# Altium schematic sheet DRV8316.SchDoc
size A4; SheetNumber: 3; SheetTotal: 4
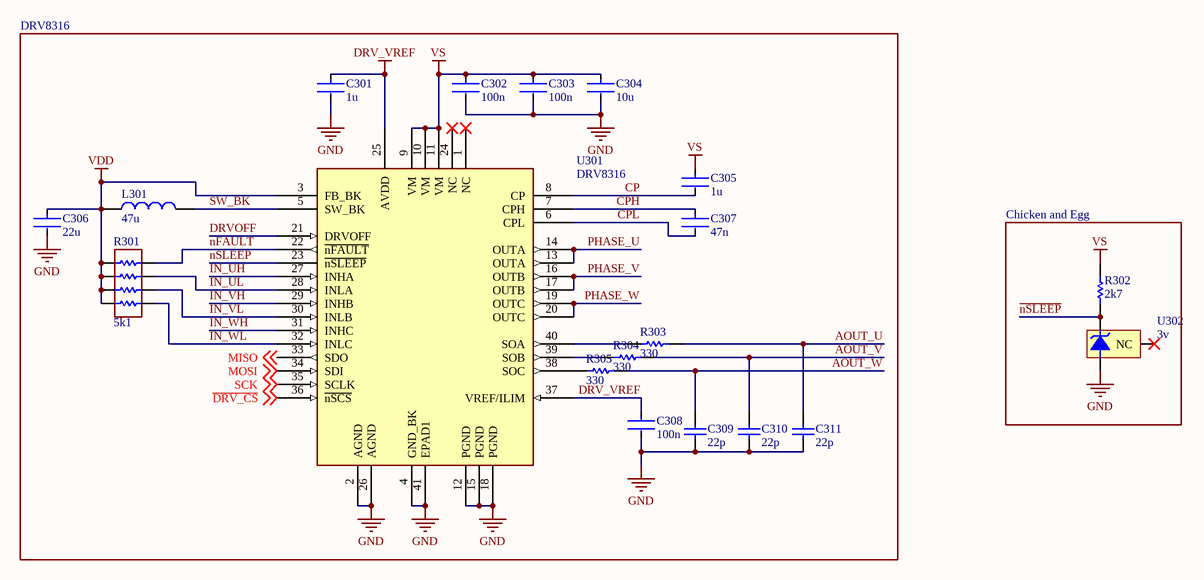
[diagram p0: DRV8316.SchDoc]

## Parts
C301  1u  [FP-GRM155-0_1-MFG]
C302  100n  [FP-GCM155-0_05-MFG]
C303  100n  [FP-GCM155-0_05-MFG]
C304  10u  [FP-GRT31C-0_2-IPC_C]
C305  1u  [FP-GRM155-0_1-MFG]
C306  22u  [FP-GRM188-0_2-IPC_C]
C307  47n  [FP-GRM155-0_05-MFG]
C308  100n  [FP-GCM155-0_05-MFG]
C309  22p  [CAPC1005X55X25LL05T10]
C310  22p  [CAPC1005X55X25LL05T10]
C311  22p  [CAPC1005X55X25LL05T10]
L301  47u  [INDC3225X25N]
R301  5k1  [CAC-50P200X100-8L]
R302  2k7  [RESC1005X04N]
R303  330  [RESC1005X04N]
R304  330  [RESC1005X04N]
R305  330  [RESC1005X04N]
U301  DRV8316  [QFN50P500X700X100_HS-41L]
U302  3v  [SOT95P237X112-3L]

## Blocks framed on the sheet
DRV8316: C301-C311 L301 R301 R303-R305 U301
Chicken and Egg: R302 U302

## Nets
DRV_VREF: C301.1 C308.1 U301.25(AVDD) U301.37(VREF/ILIM)
GND: C301.2 C302.2 C303.2 C304.2 C306.2 C308.2 C309.1 C310.1 C311.1 U301.2(AGND) U301.4(GND_BK) U301.12(PGND) U301.15(PGND) U301.18(PGND) U301.26(AGND) U301.41(EPAD1) U302.2(-V)
VDD: C306.1 L301.1 R301.1 R301.2 R301.3 R301.4 U301.3(FB_BK)
VS: C302.1 C303.1 C304.1 C305.1 R302.2 U301.9(VM) U301.10(VM) U301.11(VM)
~{DRV_CS}: U301.36(~{nSCS}) ; off-sheet ~{DRV_CS}
~{nFAULT}: R301.8 U301.22(~{nFAULT})
~{nSLEEP}: R302.1 U301.23(~{nSLEEP}) U302.1(+V)
AOUT_U: C311.2 R303.2
AOUT_V: C310.2 R304.2
AOUT_W: C309.2 R305.2
CP: C305.2 U301.8(CP)
CPH: C307.1 U301.7(CPH)
CPL: C307.2 U301.6(CPL)
DRVOFF: U301.21(DRVOFF)
IN_UH: U301.27(INHA)
IN_UL: R301.7 U301.28(INLA)
IN_VH: U301.29(INHB)
IN_VL: R301.6 U301.30(INLB)
IN_WH: U301.31(INHC)
IN_WL: R301.5 U301.32(INLC)
MISO: U301.33(SDO) ; off-sheet MISO
MOSI: U301.34(SDI) ; off-sheet MOSI
PHASE_U: U301.13(OUTA) U301.14(OUTA)
PHASE_V: U301.16(OUTB) U301.17(OUTB)
PHASE_W: U301.19(OUTC) U301.20(OUTC)
SCK: U301.35(SCLK) ; off-sheet SCK
SW_BK: L301.2 U301.5(SW_BK)
NetR303_1: R303.1 U301.40(SOA)
NetR304_1: R304.1 U301.39(SOB)
NetR305_1: R305.1 U301.38(SOC)

Not connected (* = marked no-connect by the designer): U301 1(NC)* 24(NC)*; U302 3(NC)*

## Library data of the parts
C301 C305 = GRM155R61H105ME05D: Chip Multilayer Ceramic Capacitors for General Purpose, 0402, 1.0uF, X5R, 15%, 20%, 50V; Supplier 1: Digi-Key; Supplier Part Number 1: 490-GRM155R61H105ME05DTR-ND
C302 C303 C308 = GCM155R71H104KE02J: Ceramic Capacitor for Automotive 100nF ±10% 50VDC X7R 0402 Paper T/R; Voltage Rating (DC): 50V; Case Code (Metric): 1005; Dielectric: X7R; Capacitance: 100nF; Packaging: Tape and Reel; Min Operating Temperature: -55°C; Length: 0.039inch; Thickness: 0.022inch; Height: 0.5mm; Mount: Surface Mount; Termination: SMD/SMT; Voltage Rating: 50V; Package Quantity: 50000; Width: 0.02inch; Case/Package: 0402; Case Code (Imperial): 0402; Ratings: AEC-Q200; Max Operating Temperature: 125°C; Tolerance: 10%; Weight: 0.000212oz; Supplier 1: Digi-Key; Supplier Part Number 1: 490-14514-1-ND
C304 = GRT31CR61H106ME01L: CAP CER 10UF 50V X5R 1206; Tolerance: 20%; Length: 0.126inch; Mount: Surface Mount; Packaging: Tape and Reel; Capacitance: 10uF; Case/Package: 1206; Case Code (Imperial): 1206; Max Operating Temperature: 85°C; Voltage Rating: 50V; Ratings: AEC-Q200; Min Operating Temperature: -55°C; Thickness: 0.071inch; Width: 0.063inch; Case Code (Metric): 3216; Supplier 1: Digi-Key; Supplier Part Number 1: 490-12457-1-ND
C306 = GRM188R60J226MEA0J: Chip Multilayer Ceramic Capacitors for General Purpose, 0603, 22uF, X5R, 15%, 20%, 6.3V; Capacitance: 22uF; Case Code (Metric): 1608; Thickness: 0.039inch; Dielectric: X5R; Voltage Rating: 6.3V; Termination: SMD/SMT; Voltage Rating (DC): 6.3V; Width: 0.031inch; Weight: 0.000222oz; Tolerance: 20%; Case/Package: 0603; Lead Free: Lead Free; Package Quantity: 10000; Case Code (Imperial): 0603; Length: 0.063inch; Packaging: Tape and Reel; Max Operating Temperature: 85°C; Min Operating Temperature: -55°C; Mount: Surface Mount; Supplier 1: Future Electronics; Supplier Part Number 1: 2075839
C307 = GRM155R71H473KE14D: Chip Multilayer Ceramic Capacitors for General Purpose, 0402, 47000pF, X7R, 15%, 10%, 50V; Capacitance: 47nF; Tolerance: 10%; Max Operating Temperature: 125°C; Termination: SMD/SMT; Width: 0.02inch; Package Quantity: 10000; Resistor Type: Ceramic; Packaging: Tape and Reel; Height: 0.5mm; Voltage Rating (DC): 50V; Length: 0.039inch; Dielectric: X7R; Case Code (Imperial): 0402; Voltage Rating: 50V; Mount: Surface Mount; Min Operating Temperature: -55°C; Case Code (Metric): 1005; Weight: 0.000212oz; Case/Package: 0402; Thickness: 0.022inch; Supplier 1: Digi-Key; Supplier Part Number 1: 490-10702-1-ND
C309-C311 = GRM1555C1H220GA01D: Manufacturer: Murata; Part Number: GRM1555C1H220GA01D; Supplier 1: Digi-Key; Supplier Part Number 1: 490-6219-1-ND
L301 = L1210R470KDWIT: Supplier 1: Newark; Supplier Part Number 1: 50AC9370
R301 = EXB-28V512JX: Supplier 1: Digi-Key; Supplier Part Number 1: Y7512CT-ND
R302 = ERJ-2GEJ272X: Manufacturer: Panasonic; Part Number: ERJ-2GEJ331X; Supplier 1: Digi-Key; Supplier Part Number 1: P2.7KJCT-ND
R303-R305 = ERJ-2GEJ331X: Manufacturer: Panasonic; Part Number: ERJ-2GEJ331X; Supplier 1: Digi-Key; Supplier Part Number 1: P330JCT-ND
U302 = LM4040CIM3-3.0/NOPB: Precision Micropower Shunt Voltage Reference, 3-pin SOT-23, Pb-Free; Manufacturer: National Semiconductor; PackageTopMarking: RKC*XTT; CompType: Voltage Reference IC; PowerWise: N; PackageReference: MF03A; PinCount: 3; ComponentLink1Description: LM4040 Datasheet; DatasheetVersion: Apr-2005; ComponentLink3URL: http://www.national.com/packaging/folders/mf03a.html; ComponentLink2URL: http://www.national.com/pf/LM/LM4040.html; ComponentLink1URL: http://www.national.com/ds/LM/LM4040.pdf; PackageVersion: revB, Mar-2003; RoHS: Y; RevisionNote: Component URLs added; ComponentLink2Description: LM4040 Web Page; ComponentLink3Description: MF03A Package Page; PackageDescription: Molded SOT-23, .115 x .051 x .037in Body, 3 Lead, .075 in Pitch; Supplier 1: Digi-Key; Supplier Part Number 1: LM4040CIM3-3.0/NOPBCT-ND